# EAGLE schematic untitled (EAGLE 6.5.0)
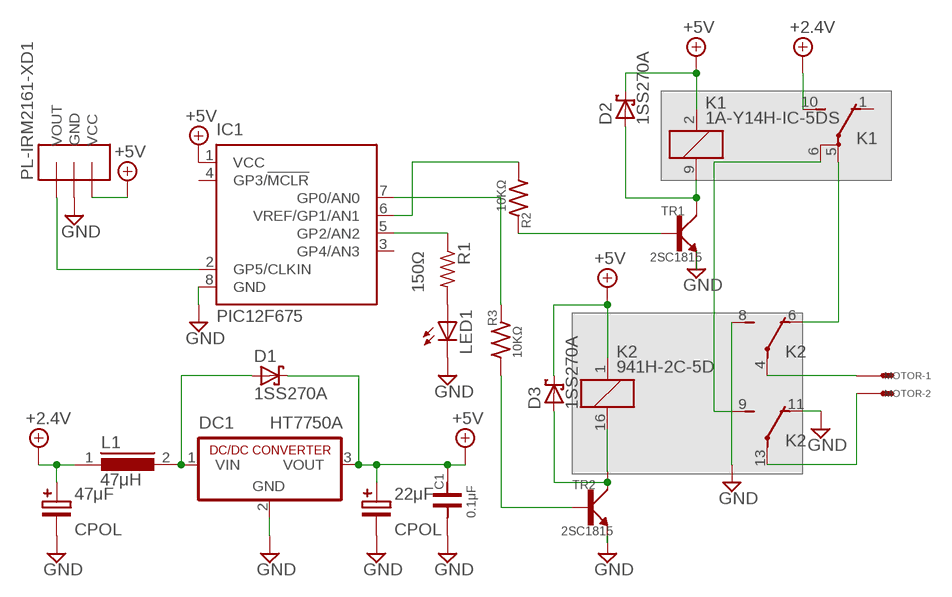
[diagram p0: schematic, sheet 1]

## Parts
22μF  CPOL  [E2-5]
47μF  CPOL  [E2-5]
C1  0.1μF  C25  [C25-25X44]
D1  1SS270A  [DO41-7.6]
D2  1SS270A  [DO41-7.6]
D3  1SS270A  [DO41-7.6]
DC1  HT7750A  [SIP3]
IC1  PIC12F675  [DIL8]
K1  1A-Y14H-IC-5DS  [G5V1]
K2  941H-2C-5D  [G5V-2]
L1  47μH  [SUKW1-17]
LED1  LED3MM  [LED3MM]
MOTOR  CON2S  [CON2]
PL-IRM2161-XD1  PL-IRM2161  [IR-RECEIVER]
R1  R-US_0207/10  [0207/10]
R2  10KΩ  R  [0204/5]
R3  10KΩ  R  [0204/5]
TR1  2SC1815  [TO92-]
TR2  2SC1815  [TO92-]

## Nets
+4.1V: 47μF.+ K1.10(2:S) L1.1 ; supply symbol labelled +2.4V
+5V: 22μF.+ C1.P$2 D1.C D2.C D3.C DC1.3(VOUT) IC1.1(VCC) K1.2 K2.1 PL-IRM2161-XD1.3(VCC)
GND: 22μF.- 47μF.- C1.P$1 DC1.2(GND) IC1.8(GND) K2.8(1:S) K2.11(2:O) LED1.K(C) PL-IRM2161-XD1.2(GND) TR1.3 TR2.3
N$1: IC1.5(GP2/AN2) R1.1
N$2: LED1.A R1.2
N$3: IC1.2(GP5/CLKIN) PL-IRM2161-XD1.1(VOUT)
N$4: K2.4(1:P) MOTOR.P$1
N$5: K2.13(2:P) MOTOR.P$2
N$6: K2.6(1:O)
N$7: K1.6(2:P) K2.9(2:S)
N$8: D2.A K1.9 TR1.2
N$9: R2.2 TR1.1
N$10: IC1.6(VREF/GP1/AN1) R2.1
N$11: K2.16 TR2.2
N$12: R3.1 TR2.1
N$13: IC1.7(GP0/AN0) R3.2
N$14: D1.A DC1.1(VIN) L1.2
N$17: D3.A
Unconnected: IC1.3(GP4/AN3) IC1.4(GP3/!MCLR) K1.1(2:O) K1.5(2:P)

## Library data of the parts
22μF 47μF = 00_ir:CPOL
C1 = 00_jikken:C
D1-D3 = 00_diode:1SS270: 1.0A SCHOTTKY BARRIER RECTIFIER Source: http://www.diodes.com/datasheets/ds23001.pdf
DC1 = 00_jikken:HT7750A: INNOLINE DC/DC-Converter 1.0 AMP SIP3 Single Output Source: Data sheet <http://www.mikrocontroller.net/attachment/150645/157764-da-01-en-DC_DC_WANDLER_R_78C5_0_1_0.pdf>
IC1 = 00_microchip:PIC12F675: 8-Pin FLASH-Based 8-Bit CMOS Microcontroller Precision Internal 4 MHz oscillator factory calibrated to ±1% Low Power Features: Standby Current: - 1 nA @ 2.0V, typical Operating Current: - 8.5µA @ 32 kHz, 2.0V, typical - 100µA @ 1 MHz, 2.0V, typical Watchdog Timer Current: - 300 nA @ 2.0V, typical Timer1 oscillator current: - 4µA @ 32 kHz, 2.0V, typical Analog-to-Digital Converter module: - 10-bit resolution - Programmable 4-channel input - Voltage reference input Source: http://www.microchip.com .. 41190E.pdf; MF: MICROCHIP; MPN: PIC12F675-E/P; OC_FARNELL: 9759018; OC_NEWARK: 92C4340
K1 = 00_relay:1A-Y14H-IC-5DS: RELAY 1 x switch, 0.5 A/125 V AC, 1 A/24 V DC , Omron; MPN: G5V-1-DC24; OC_FARNELL: 9949593; OC_NEWARK: 36M6377
K2 = 00_relay:941H-2C-5D: OMRON PCB Relay Source: http://www.omron.com/ecb/products/pdf/en-g5v2.pdf; MPN: G5V-2 5DC; OC_FARNELL: 9949488; OC_NEWARK: 78K5703
L1 = 00_inductors:47μH: INDUCTOR
LED1 = led:LED: LED OSRAM: - CHIPLED LG R971, LG N971, LY N971, LG Q971, LY Q971, LO R971, LY R971 LH N974, LH R974 LS Q976, LO Q976, LY Q976 LO Q996 - Hyper CHIPLED LW Q18S LB Q993, LB Q99A, LB R99A - SideLED LS A670, LO A670, LY A670, LG A670, LP A670 LB A673, LV A673, LT A673, LW A673 LH A674 LY A675 LS A676, LA A676, LO A676, LY A676, LW A676 LS A679, LY A679, LG A679 - Hyper Micro SIDELED® LS Y876, LA Y876, LO Y876, LY Y876 LT Y87S - SmartLED LW L88C, LW L88S LB L89C, LB L89S, LG L890 LS L89K, LO L89K, LY L89K LS L896, LA L896, LO L896, LY L896 - TOPLED LS T670, LO T670, LY T670, LG T670, LP T670 LSG T670, LSP T670, LSY T670, LOP T670, LYG T670 LG T671, LOG T671, LSG T671 LB T673, LV T673, LT T673, LW T673 LH T674 LS T676, LA T676, LO T676, LY T676, LB T676, LH T676, LSB T676, LW T676 LB T67C, LV T67C, LT T67C, LS T67K, LO T67K, LY T67K, LW E67C LS E67B, LA E67B, LO E67B, LY E67B, LB E67C, LV E67C, LT E67C LW T67C LS T679, LY T679, LG T679 LS T770, LO T770, LY T770, LG T770, LP T770 LB T773, LV T773, LT T773, LW T773 LH T774 LS E675, LA E675, LY E675, LS T675 LS T776, LA T776, LO T776, LY T776, LB T776 LHGB T686 LT T68C, LB T68C - Hyper Mini TOPLED® LB M676 - Mini TOPLED Santana® LG M470 LS M47K, LO M47K, LY M47K Source: http://www.osram.convergy.de LUXEON: - LUMILED® LXK2-PW12-R00, LXK2-PW12-S00, LXK2-PW14-U00, LXK2-PW14-V00 LXK2-PM12-R00, LXK2-PM12-S00, LXK2-PM14-U00 LXK2-PE12-Q00, LXK2-PE12-R00, LXK2-PE12-S00, LXK2-PE14-T00, LXK2-PE14-U00 LXK2-PB12-K00, LXK2-PB12-L00, LXK2-PB12-M00, LXK2-PB14-N00, LXK2-PB14-P00, LXK2-PB14-Q00 LXK2-PR12-L00, LXK2-PR12-M00, LXK2-PR14-Q00, LXK2-PR14-R00 LXK2-PD12-Q00, LXK2-PD12-R00, LXK2-PD12-S00 LXK2-PH12-R00, LXK2-PH12-S00 LXK2-PL12-P00, LXK2-PL12-Q00, LXK2-PL12-R00 Source: www.luxeon.com KINGBRIGHT: KA-3528ASYC Source: www.kingbright.com
MOTOR = 00_jikken:CON2S
PL-IRM2161-XD1 = ir:PL-IRM2161: PL-IRM2161-XD1 IR Receiver http://akizukidenshi.com/catalog/g/gI-06491/ http://akizukidenshi.com/download/ds/paralight/PL-IRM2161-XD1.pdf
R1 = rcl:R-US_: RESISTOR, American symbol; R: 150Ω
R2 R3 = 00_jikken:R
TR1 TR2 = 00_jikken:2SC1815